# Altium schematic sheet Voltage-Monitor.SchDoc
size A
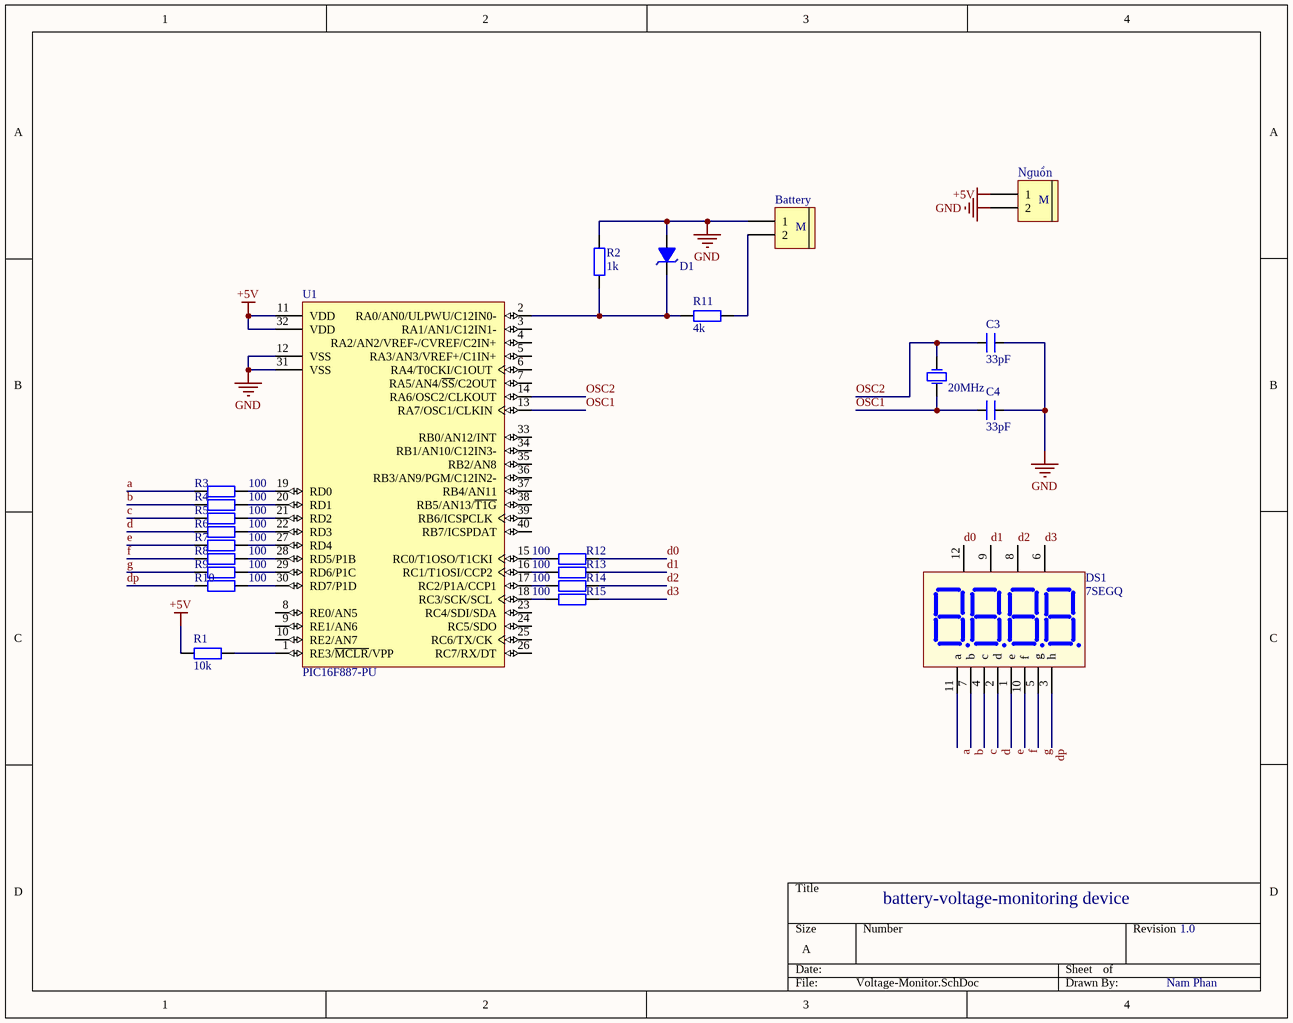
[diagram p0: Voltage-Monitor.SchDoc]

## Parts
Battery  Header 2 - M  [Medium - Header 2]  (value not drawn)
C3  33pF  [CN1.5]
C4  33pF  [CN1.5]
D1  Diode Zener  [D1A]  (value not drawn)
DS1  7SEGQ  [LED7SEG-4-0.56]
Nguồn  Header 2 - M  [Medium - Header 2]  (value not drawn)
R1  10k  [R1/4W]
R2  1k  [R1/4W]
R3  100  [RESC-0603 (1608)]
R4  100  [RESC-0603 (1608)]
R5  100  [RESC-0603 (1608)]
R6  100  [RESC-0603 (1608)]
R7  100  [RESC-0603 (1608)]
R8  100  [RESC-0603 (1608)]
R9  100  [RESC-0603 (1608)]
R10  100  [RESC-0603 (1608)]
R11  4k  [R1/4W]
R12  100  [RESC-0603 (1608)]
R13  100  [RESC-0603 (1608)]
R14  100  [RESC-0603 (1608)]
R15  100  [RESC-0603 (1608)]
U1  PIC16F887-PU  [DIP40/W0.6]
Y1  20MHz  [XT2]

## Nets
+5V: Nguồn.1 R1.1 U1.11(VDD) U1.32(VDD)
GND: Battery.1 C3.2 C4.2 D1.1(A) Nguồn.2 R2.2 U1.12(VSS) U1.31(VSS)
a: DS1.11(a) R3.1
b: DS1.7(b) R4.1
c: DS1.4(c) R5.1
d: DS1.2(d) R6.1
d0: DS1.12(V1) R12.2
d1: DS1.9(V2) R13.2
d2: DS1.8(V3) R14.2
d3: DS1.6(V4) R15.2
dp: DS1.3(h) R10.1
e: DS1.1(e) R7.1
f: DS1.10(f) R8.1
g: DS1.5(g) R9.1
OSC1: C4.1 U1.13(RA7/OSC1/CLKIN) Y1.1(OSC1)
OSC2: C3.1 U1.14(RA6/OSC2/CLKOUT) Y1.2(OSC2)
NetBattery_2: Battery.2 R11.2
NetD1_2: D1.2(K) R2.1 R11.1 U1.2(RA0/AN0/ULPWU/C12IN0-)
NetR1_2: R1.2 U1.1(RE3/~{MCLR}/VPP)
NetR3_2: R3.2 U1.19(RD0)
NetR4_2: R4.2 U1.20(RD1)
NetR5_2: R5.2 U1.21(RD2)
NetR6_2: R6.2 U1.22(RD3)
NetR7_2: R7.2 U1.27(RD4)
NetR8_2: R8.2 U1.28(RD5/P1B)
NetR9_2: R9.2 U1.29(RD6/P1C)
NetR10_2: R10.2 U1.30(RD7/P1D)
NetR12_1: R12.1 U1.15(RC0/T1OSO/T1CKI)
NetR13_1: R13.1 U1.16(RC1/T1OSI/CCP2)
NetR14_1: R14.1 U1.17(RC2/P1A/CCP1)
NetR15_1: R15.1 U1.18(RC3/SCK/SCL)

Not connected (* = marked no-connect by the designer): U1 3(RA1/AN1/C12IN1-) 4(RA2/AN2/VREF-/CVREF/C2IN+) 5(RA3/AN3/VREF+/C1IN+) 6(RA4/T0CKI/C1OUT) 7(RA5/AN4/~{SS}/C2OUT) 8(RE0/AN5) 9(RE1/AN6) 10(RE2/AN7) 23(RC4/SDI/SDA) 24(RC5/SDO) 25(RC6/TX/CK) 26(RC7/RX/DT) 33(RB0/AN12/INT) 34(RB1/AN10/C12IN3-) 35(RB2/AN8) 36(RB3/AN9/PGM/C12IN2-) 37(RB4/AN11) 38(RB5/AN13/~{T1G}) 39(RB6/ICSPCLK) 40(RB7/ICSPDAT)

## Notes on the sheet
- battery-voltage-monitoring device
- 1.0
- Nam Phan
- (in symbol Header 2 - M) M

## Library data of the parts
Battery Nguồn = Header 2 - M: Header, 2-Pin, Medium; LatestRevisionDate: 17-Jul-2002; LatestRevisionNote: Re-released for DXP Platform.; Publisher: Altium Limited
C3 C4 = CN1.5: Cap np 682pF => 104pF; Value: 0.01uF
D1 = Diode Zener: Diode  Zener
DS1 = LED7SEG-4: Four 7 Seg Dipslay; Value: LED 7Q SEG
R1 R2 R11 = R1/4W: Resistor 1/4W; Value: R1/4W - 1K
R3-R10 R12-R15 = RC0603FR-075K6L: RES SMD 5.6K OHM 1% 1/10W 0603; Value: 5K6; CompanyID: VT-00869; Solder: SMT; MPN: RC0603FR-075K6L; Category: RESISTOR
U1 = PIC16F887-PU: Flash-Based, 8-Bit CMOS Microcontroller with nanoWatt Technology, 8K (x14-Bit words) Program Memory, 624 Bytes Data Memory, 35 I/O pins, 40-Pin PDIP, Standard VDD Range, Extended Temperature; Published: 29-Jan-2009; LatestRevisionDate: 02-Dec-2009; LatestRevisionNote: Updated datasheet to version revF, Apr-2009.; DatasheetVersion: revF, Apr-2009; PackageVersion: revBB, Aug-2009; PackageReference: PDIP600-P40; Publisher: Altium Limited; PackageDescription: 40-Lead Plastic Dual In-Line (P) - 600 mil Body [PDIP]; Supplier 1: Digi-Key; Supplier Part Number 1: PIC16F887-E/P-ND; Supplier 2: Farnell; Supplier Part Number 2: 1703423; ComponentLink1Description: Datasheet; ComponentLink1URL: http://ww1.microchip.com/downloads/en/DeviceDoc/41291F.pdf; ComponentLink2Description: Packaging Specification; ComponentLink2URL: http://www.microchip.com/stellent/groups/techpub_sg/documents/packagingspec/en012702.pdf; ComponentLink3Description: Microchip.com Home; ComponentLink3URL: http://www.microchip.com/
Y1 = Crystal: Crystal Oscillator; Published: 8-Jun-2000; LatestRevisionDate: 17-Jul-2002; LatestRevisionNote: Re-released for DXP Platform.; PackageReference: R38; Publisher: Altium Limited